# EAGLE design connector board (EAGLE 9.6.2)
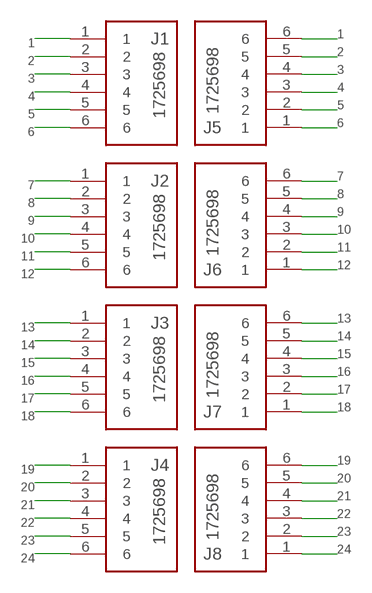
[diagram p0: schematic, sheet 1]

## Parts
J1  1725698  [SHDR6W90P0X254_1X6_1570X620X85]
J2  1725698  [SHDR6W90P0X254_1X6_1570X620X85]
J3  1725698  [SHDR6W90P0X254_1X6_1570X620X85]
J4  1725698  [SHDR6W90P0X254_1X6_1570X620X85]
J5  1725698  [SHDR6W90P0X254_1X6_1570X620X85]
J6  1725698  [SHDR6W90P0X254_1X6_1570X620X85]
J7  1725698  [SHDR6W90P0X254_1X6_1570X620X85]
J8  1725698  [SHDR6W90P0X254_1X6_1570X620X85]

## Nets
1: J1.1 J5.6
2: J1.2 J5.5
3: J1.3 J5.4
4: J1.4 J5.3
5: J1.5 J5.2
6: J1.6 J5.1
7: J2.1 J6.6
8: J2.2 J6.5
9: J2.3 J6.4
10: J2.4 J6.3
11: J2.5 J6.2
12: J2.6 J6.1
13: J3.1 J7.6
14: J3.2 J7.5
15: J3.3 J7.4
16: J3.4 J7.3
17: J3.5 J7.2
18: J3.6 J7.1
19: J4.1 J8.6
20: J4.2 J8.5
21: J4.3 J8.4
22: J4.4 J8.3
23: J4.5 J8.2
24: J4.6 J8.1

## Library data of the parts
J1-J8 = 154N_NAU7802_TH:1725698: 6 way PCB vertical mount terminal,2.54mm 6 way PCB vertical mount terminal,2.54mm Source: Datasheet; ALLIED_NUMBER: 70054339; DESCRIPTION: 6 way PCB vertical mount terminal,2.54mm 6 way PCB vertical mount terminal,2.54mm; HEIGHT: 8.5mm; MANUFACTURER_NAME: Phoenix Contact; MANUFACTURER_PART_NUMBER: 1725698; RS_PART_NUMBER: 3909045; RS_PRICE-STOCK: https://uk.rs-online.com/web/p/products/3909045

## Board
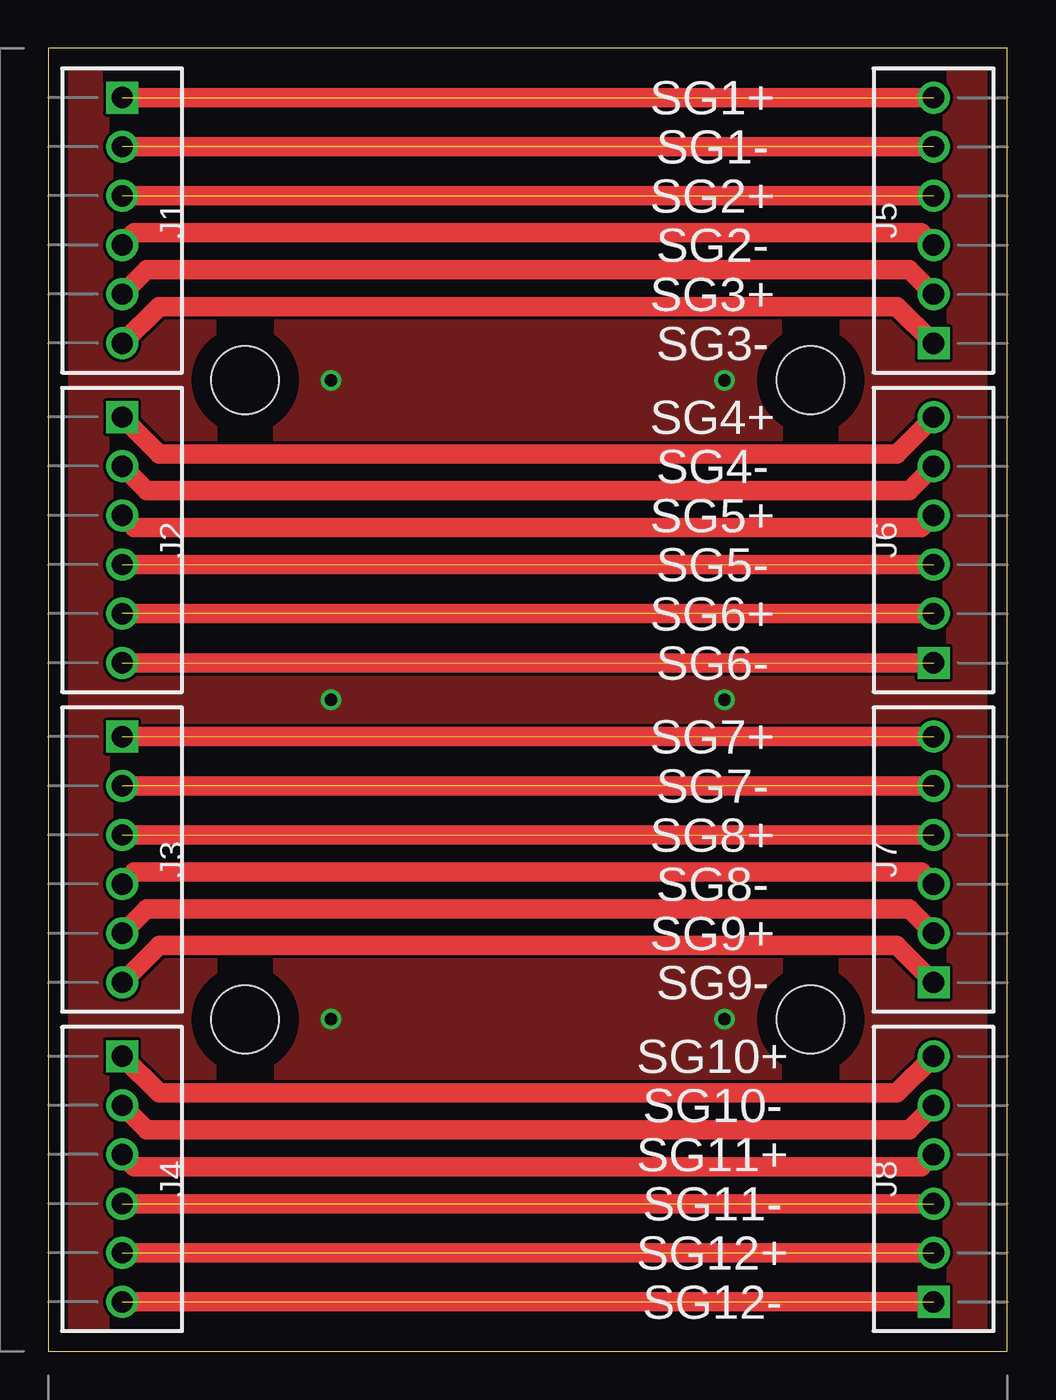
[diagram p1: board, top side]
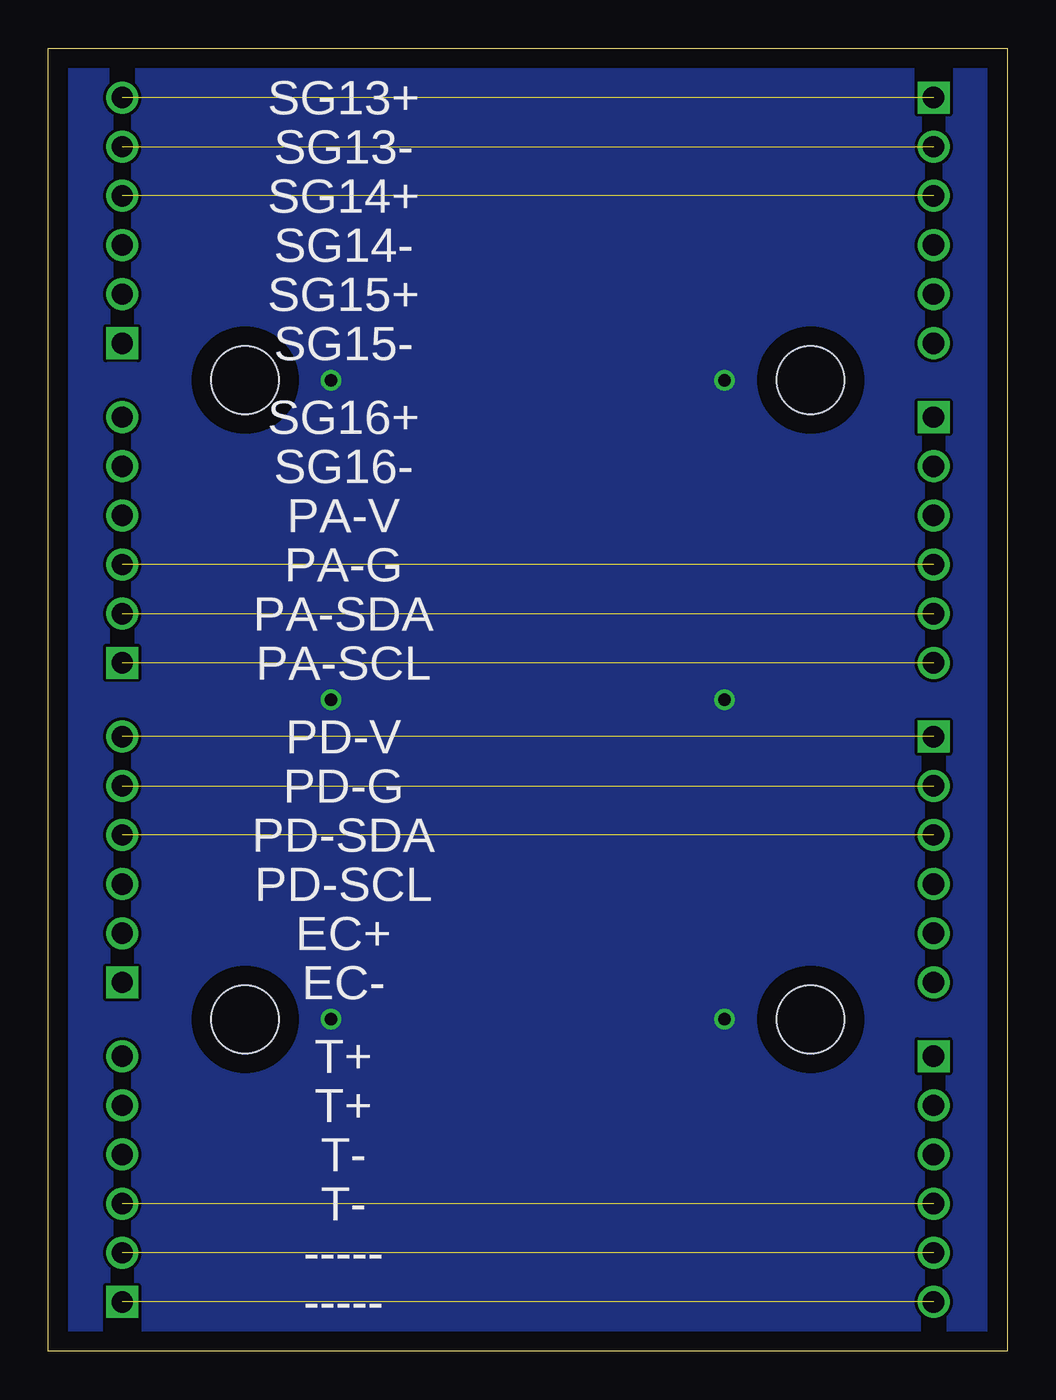
[diagram p2: board, bottom side, seen from below]

Size 49.53 x 67.31 mm. Coordinates in mm from the lower left corner, seen from the top.
Outline: 0,0 49.53,0 49.53,67.31 0,67.31 0,0
Copper layers (1*16): Top 0.035mm / dielectric 1.5mm / Bottom 0.035mm
Design rules "default": minimum track width 6mil, minimum drill 0.35mm, track to track 6mil, track to pad 6mil, pad to pad 6mil, via to via 6mil, smd to smd 6mil, copper to edge 40mil, drill to drill 6mil, minimum pad ring 10mil, minimum via ring 8mil, stop-mask expansion 4mil, vias tented up to drill 0mil, thermal gap 10mil
Holes 3.5 mm at 10.16,50.16 39.37,50.16 10.16,17.14 39.37,17.14

### Footprints (pad centres in the part's own frame; a part is rotated, then mirrored left to right if it is on the bottom)
SHDR6W90P0X254_1X6_1570X620X85 = drill 1.1 pad 1.65 square: 1 0,0 | drill 1.1 pad 1.65: 2 2.54,0; 3 5.08,0; 4 7.62,0; 5 10.16,0; 6 12.7,0

### Placement (x,y rotation side)
J1  3.81,64.77 270 top
J2  3.81,48.26 270 top
J3  3.81,31.75 270 top
J4  3.81,15.24 270 top
J5  45.72,52.07 90 top
J6  45.72,35.56 90 top
J7  45.72,19.05 90 top
J8  45.72,2.54 90 top

### Tracks (layer width: path | path; a pad name or v marks a point on that pad's centre or on a via)
1  (1 unrouted)
  Top 1.016: J1.1 J5.6
2  (1 unrouted)
  Top 1.016: J5.5 J1.2
3  (1 unrouted)
  Top 1.016: J1.3 J5.4
4
  Top 1.016: J5.3 45.09,57.78 4.45,57.78 J1.4
5
  Top 1.016: J1.5 5.08,55.88 44.45,55.88 J5.2
6
  Top 1.016: J1.6 5.71,53.98 43.81,53.98 J5.1
7
  Top 1.016: J2.1 5.71,46.35 43.81,46.35 J6.6
8
  Top 1.016: J2.2 5.08,44.45 44.45,44.45 J6.5
9
  Top 1.016: J6.4 45.09,42.55 4.45,42.55 J2.3
10  (1 unrouted)
  Top 1.016: J2.4 J6.3
11  (1 unrouted)
  Top 1.016: J6.2 J2.5
12  (1 unrouted)
  Top 1.016: J2.6 J6.1
13  (1 unrouted)
  Top 1.016: J3.1 J7.6
14  (1 unrouted)
  Top 1.016: J7.5 J3.2
15  (1 unrouted)
  Top 1.016: J3.3 J7.4
16
  Top 1.016: J7.3 45.09,24.77 4.45,24.77 J3.4
17
  Top 1.016: J3.5 5.08,22.86 44.45,22.86 J7.2
18
  Top 1.016: J7.1 43.81,20.95 5.71,20.95 J3.6
19
  Top 1.016: J8.6 43.81,13.34 5.71,13.34 J4.1
20
  Top 1.016: J8.5 44.45,11.43 5.08,11.43 J4.2
21
  Top 1.016: J4.3 4.45,9.53 45.09,9.53 J8.4
22  (1 unrouted)
  Top 1.016: J4.4 J8.3
23  (1 unrouted)
  Top 1.016: J4.5 J8.2
24  (1 unrouted)
  Top 1.016: J4.6 J8.1
G  (via drill 0.65)
  other vias: 14.61,50.16 34.92,50.16 14.61,17.14 34.92,17.14 14.61,33.66 34.92,33.66
  pour Top: 0,67.31 49.53,67.31 49.53,0 0,0
  pour Bottom: 0,67.31 49.53,67.31 49.53,0 0,0

### Text on the board
tPlace: SG1+ | SG1- | SG2+ | SG2- | SG3+ | SG3- | SG4+ | SG4- | SG5+ | SG5- | SG6+ | SG6- | SG7+ | SG7- | SG8+ | SG8- | SG9+ | SG9- | SG10+ | SG10- | SG11+ | SG11- | SG12+ | SG12-
bPlace: SG13+ | SG13- | SG14+ | SG14- | SG15+ | SG15- | SG16+ | SG16- | PA-V | PA-G | PA-SDA | PA-SCL | PD-V | PD-G | PD-SDA | PD-SCL | EC+ | EC- | T+ | T+ | T- | T- | ----- | -----